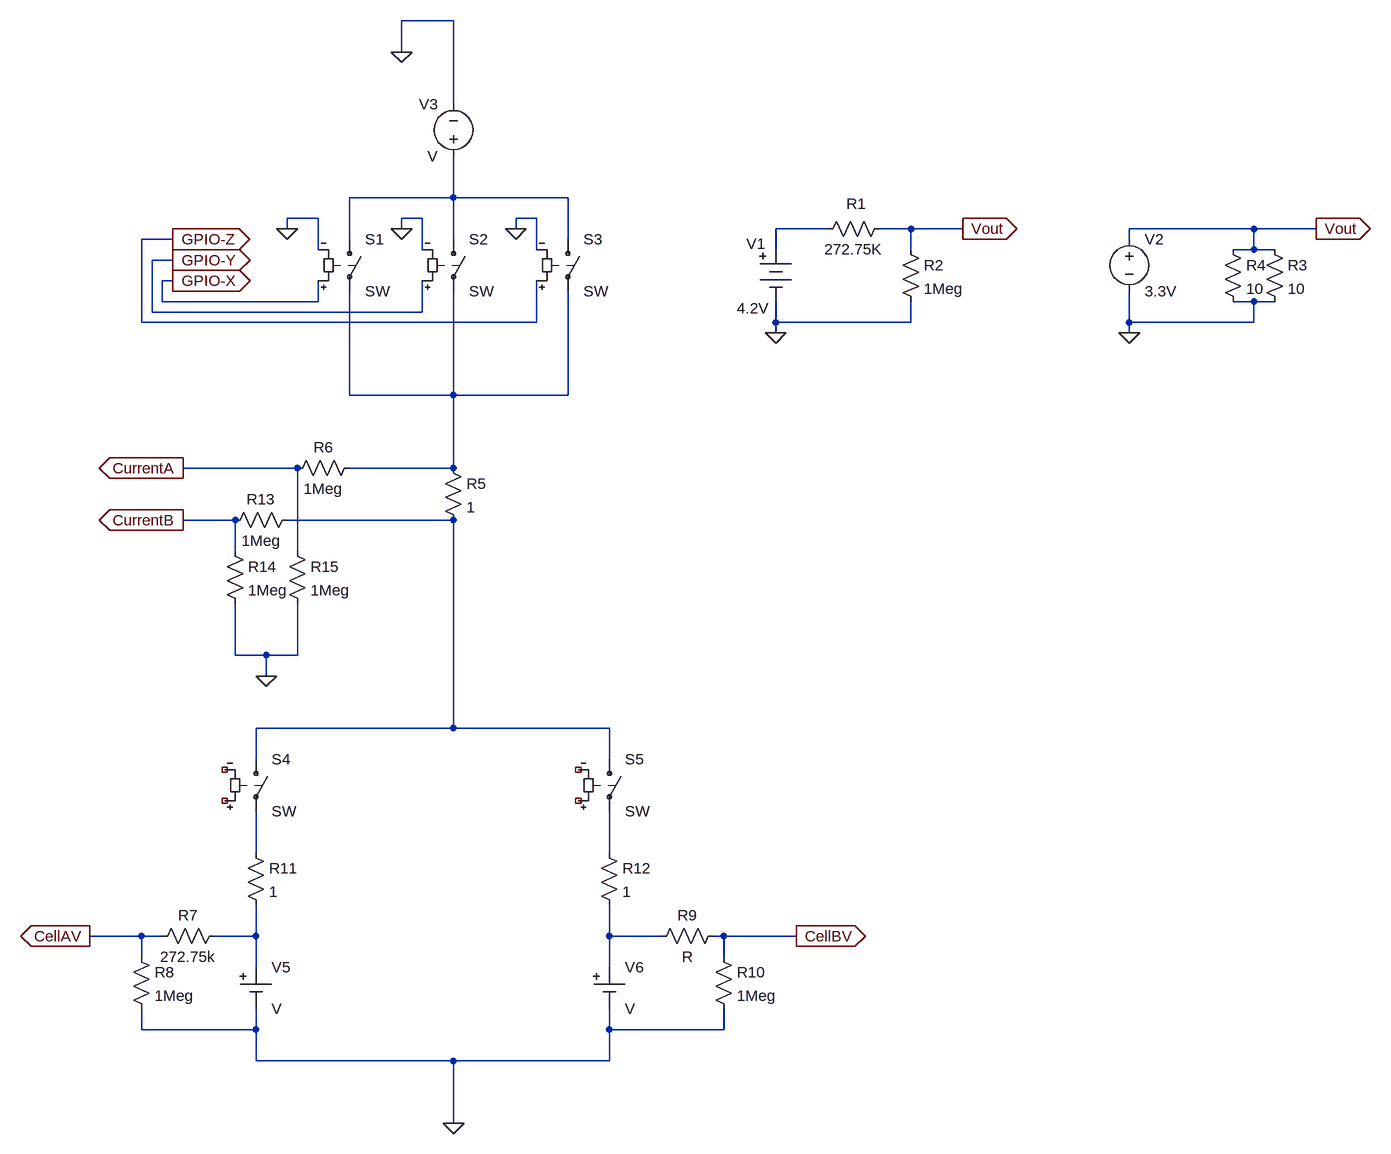
[diagram p0: schematic battery_management_system.asc]
battery_management_system.asc, the LTspice schematic file:
Version 4
SHEET 1 1072 1396
WIRE -368 -320 -448 -320
WIRE -448 -272 -448 -320
WIRE -368 -192 -368 -320
WIRE -368 -48 -368 -112
WIRE -368 -48 -528 -48
WIRE -192 -48 -368 -48
WIRE -576 -16 -624 -16
WIRE -416 -16 -448 -16
WIRE -240 -16 -272 -16
WIRE -624 0 -624 -16
WIRE -448 0 -448 -16
WIRE -272 0 -272 -16
WIRE 208 0 128 0
WIRE 336 0 288 0
WIRE 416 0 336 0
WIRE 864 0 672 0
WIRE 960 0 864 0
WIRE -800 16 -848 16
WIRE -528 16 -528 -48
WIRE -368 16 -368 -48
WIRE -192 16 -192 -48
WIRE 672 16 672 0
WIRE -576 32 -576 -16
WIRE -416 32 -416 -16
WIRE -240 32 -240 -16
WIRE 128 32 128 0
WIRE 336 32 336 0
WIRE 864 32 864 0
WIRE 864 32 832 32
WIRE 896 32 864 32
WIRE -800 48 -832 48
WIRE -800 80 -816 80
WIRE -816 112 -816 80
WIRE -576 112 -576 80
WIRE -576 112 -816 112
WIRE 864 112 832 112
WIRE 896 112 864 112
WIRE -832 128 -832 48
WIRE -416 128 -416 80
WIRE -416 128 -832 128
WIRE -848 144 -848 16
WIRE -240 144 -240 80
WIRE -240 144 -848 144
WIRE 128 144 128 112
WIRE 336 144 336 112
WIRE 336 144 128 144
WIRE 672 144 672 96
WIRE 864 144 864 112
WIRE 864 144 672 144
WIRE 128 160 128 144
WIRE 672 160 672 144
WIRE -528 256 -528 96
WIRE -368 256 -368 96
WIRE -368 256 -528 256
WIRE -192 256 -192 96
WIRE -192 256 -368 256
WIRE -608 368 -784 368
WIRE -368 368 -368 256
WIRE -368 368 -528 368
WIRE -704 448 -784 448
WIRE -368 448 -624 448
WIRE -704 496 -704 448
WIRE -608 496 -608 368
WIRE -704 656 -704 576
WIRE -656 656 -704 656
WIRE -608 656 -608 576
WIRE -608 656 -656 656
WIRE -656 688 -656 656
WIRE -368 768 -368 448
WIRE -368 768 -672 768
WIRE -128 768 -368 768
WIRE -672 816 -672 768
WIRE -128 816 -128 768
WIRE -672 960 -672 896
WIRE -128 960 -128 896
WIRE -848 1088 -928 1088
WIRE -816 1088 -848 1088
WIRE -672 1088 -672 1040
WIRE -672 1088 -736 1088
WIRE -128 1088 -128 1040
WIRE -48 1088 -128 1088
WIRE 48 1088 32 1088
WIRE 160 1088 48 1088
WIRE -848 1120 -848 1088
WIRE 48 1120 48 1088
WIRE -672 1136 -672 1088
WIRE -128 1136 -128 1088
WIRE -848 1232 -848 1200
WIRE -672 1232 -672 1200
WIRE -672 1232 -848 1232
WIRE -128 1232 -128 1200
WIRE 48 1232 48 1200
WIRE 48 1232 -128 1232
WIRE -672 1280 -672 1232
WIRE -368 1280 -672 1280
WIRE -128 1280 -128 1232
WIRE -128 1280 -368 1280
WIRE -368 1376 -368 1280
FLAG 128 160 0
FLAG 416 0 Vout
IOPIN 416 0 Out
FLAG 960 0 Vout
IOPIN 960 0 Out
FLAG 672 160 0
FLAG -448 -272 0
FLAG -272 0 0
FLAG -448 0 0
FLAG -624 0 0
FLAG -800 80 GPIO-X
IOPIN -800 80 Out
FLAG -800 48 GPIO-Y
IOPIN -800 48 Out
FLAG -800 16 GPIO-Z
IOPIN -800 16 Out
FLAG -928 1088 CellAV
IOPIN -928 1088 Out
FLAG 160 1088 CellBV
IOPIN 160 1088 Out
FLAG -368 1376 0
FLAG -656 688 0
FLAG -784 368 CurrentA
IOPIN -784 368 Out
FLAG -784 448 CurrentB
IOPIN -784 448 Out
SYMBOL Misc\\battery 128 16 R0
WINDOW 0 -45 7 Left 2
WINDOW 3 -60 106 Left 2
WINDOW 123 0 0 Left 0
WINDOW 39 0 0 Left 0
SYMATTR InstName V1
SYMATTR Value 4.2V
SYMBOL res 304 -16 R90
WINDOW 0 -7 52 VBottom 2
WINDOW 3 32 56 VTop 2
SYMATTR InstName R1
SYMATTR Value 272.75K
SYMBOL res 320 16 R0
SYMATTR InstName R2
SYMATTR Value 1Meg
SYMBOL voltage 672 0 R0
WINDOW 123 0 0 Left 0
WINDOW 39 0 0 Left 0
SYMATTR InstName V2
SYMATTR Value 3.3V
SYMBOL res 880 16 R0
SYMATTR InstName R3
SYMATTR Value 10
SYMBOL res 816 16 R0
SYMATTR InstName R4
SYMATTR Value 10
SYMBOL sw -528 0 R0
SYMATTR InstName S1
SYMBOL sw -368 0 R0
SYMATTR InstName S2
SYMBOL sw -192 0 R0
SYMATTR InstName S3
SYMBOL voltage -368 -96 R180
WINDOW 0 24 96 Left 2
WINDOW 3 24 16 Left 2
SYMATTR InstName V3
SYMBOL res -384 352 R0
SYMATTR InstName R5
SYMATTR Value 1
SYMBOL sw -672 800 R0
SYMATTR InstName S4
SYMBOL sw -128 800 R0
SYMATTR InstName S5
SYMBOL Misc\\cell -672 1136 R0
SYMATTR InstName V5
SYMBOL Misc\\cell -128 1136 R0
SYMATTR InstName V6
SYMBOL res -832 1104 R270
WINDOW 0 32 56 VTop 2
WINDOW 3 0 56 VBottom 2
SYMATTR InstName R7
SYMATTR Value 272.75k
SYMBOL res -864 1104 R0
SYMATTR InstName R8
SYMATTR Value 1Meg
SYMBOL res -64 1104 R270
WINDOW 0 32 56 VTop 2
WINDOW 3 0 56 VBottom 2
SYMATTR InstName R9
SYMBOL res 32 1104 R0
SYMATTR InstName R10
SYMATTR Value 1Meg
SYMBOL res -688 944 R0
SYMATTR InstName R11
SYMATTR Value 1
SYMBOL res -144 944 R0
SYMATTR InstName R12
SYMATTR Value 1
SYMBOL res -512 352 R90
WINDOW 0 0 56 VBottom 2
WINDOW 3 32 56 VTop 2
SYMATTR InstName R6
SYMATTR Value 1Meg
SYMBOL res -608 432 R90
WINDOW 0 0 56 VBottom 2
WINDOW 3 32 56 VTop 2
SYMATTR InstName R13
SYMATTR Value 1Meg
SYMBOL res -720 480 R0
SYMATTR InstName R14
SYMATTR Value 1Meg
SYMBOL res -624 480 R0
SYMATTR InstName R15
SYMATTR Value 1Meg

The netlist it stands for:
* battery_management_system.asc
V1 N002 0 4.2V
R1 Vout N002 272.75K
R2 Vout 0 1Meg
V2 Vout 0 3.3V
R3 Vout 0 10
R4 Vout 0 10
S1 N001 N003 GPIO-X 0 SW
S2 N001 N003 GPIO-Y 0 SW
S3 N001 N003 GPIO-Z 0 SW
V3 N001 0 V
R5 N003 N004 1
S4 N004 N005 NC_01 NC_02 SW
S5 N004 N006 NC_03 NC_04 SW
V5 N007 0 V
V6 N008 0 V
R7 CellAV N007 272.75k
R8 CellAV 0 1Meg
R9 N008 CellBV R
R10 CellBV 0 1Meg
R11 N005 N007 1
R12 N006 N008 1
R6 N003 CurrentA 1Meg
R13 N004 CurrentB 1Meg
R14 CurrentB 0 1Meg
R15 CurrentA 0 1Meg
.backanno
.end